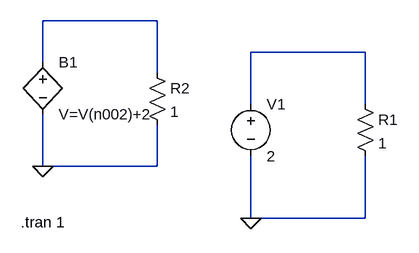
[diagram p0: schematic bv.asc]
bv.asc, the LTspice schematic file:
Version 4
SHEET 1 880 680
WIRE 80 16 -96 16
WIRE 400 64 224 64
WIRE -96 80 -96 16
WIRE 80 96 80 16
WIRE 224 144 224 64
WIRE 400 144 400 64
WIRE -96 240 -96 160
WIRE 80 240 80 176
WIRE 80 240 -96 240
WIRE 224 320 224 224
WIRE 400 320 400 224
WIRE 400 320 224 320
FLAG -96 240 0
FLAG 224 320 0
SYMBOL res 384 128 R0
SYMATTR InstName R1
SYMATTR Value 1
SYMBOL res 64 80 R0
SYMATTR InstName R2
SYMATTR Value 1
SYMBOL voltage 224 128 R0
WINDOW 123 0 0 Left 0
WINDOW 39 0 0 Left 0
SYMATTR InstName V1
SYMATTR Value 2
SYMBOL bv -96 64 R0
SYMATTR InstName B1
SYMATTR Value V=V(n002)+2
TEXT -130 326 Left 2 !.tran 1

The netlist it stands for:
* bv.asc
R1 N002 0 1
R2 N001 0 1
V1 N002 0 2
B1 N001 0 V=V(n002)+2
.tran 1
.backanno
.end